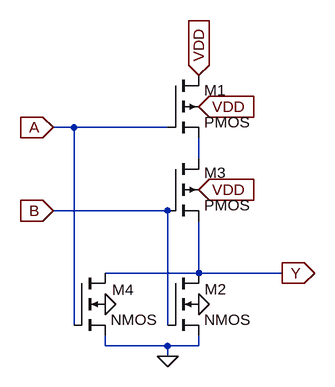
[diagram p0: schematic NOR.asc]
NOR.asc, the LTspice schematic file:
Version 4
SHEET 1 880 856
WIRE 16 368 -16 368
WIRE 160 368 16 368
WIRE 208 416 208 384
WIRE 160 496 -16 496
WIRE 208 592 208 512
WIRE 208 592 64 592
WIRE 336 592 208 592
WIRE 16 672 16 368
WIRE 160 672 160 496
WIRE 64 704 64 688
WIRE 160 704 64 704
WIRE 208 704 208 688
WIRE 208 704 160 704
WIRE 160 720 160 704
FLAG 160 720 0
FLAG 208 640 0
FLAG 64 640 0
FLAG -16 368 A
IOPIN -16 368 In
FLAG -16 496 B
IOPIN -16 496 In
FLAG 208 464 VDD
IOPIN 208 464 In
FLAG 208 336 VDD
IOPIN 208 336 In
FLAG 208 288 VDD
IOPIN 208 288 In
FLAG 336 592 Y
IOPIN 336 592 Out
SYMBOL nmos4 160 592 R0
WINDOW 0 57 25 Left 2
SYMATTR InstName M2
SYMATTR Value2 l=90n w=200n
SYMBOL nmos4 16 592 R0
WINDOW 0 59 26 Left 2
SYMATTR InstName M4
SYMATTR Value2 l=90n w=200n
SYMBOL pmos4 160 288 R0
WINDOW 0 56 23 Left 2
SYMATTR InstName M1
SYMATTR Value2 l=90n w=400n
SYMBOL pmos4 160 416 R0
WINDOW 0 56 22 Left 2
SYMATTR InstName M3
SYMATTR Value2 l=90n w=400n

The netlist it stands for:
* NOR.asc
M2 Y B 0 0 NMOS l=90n w=200n
M4 Y A 0 0 NMOS l=90n w=200n
M1 VDD A N001 VDD PMOS l=90n w=400n
M3 N001 B Y VDD PMOS l=90n w=400n
.model NMOS NMOS
.model PMOS PMOS
.lib standard.mos
.backanno
.end